# EAGLE schematic DoorOpenerPCB (EAGLE 9.0.1)
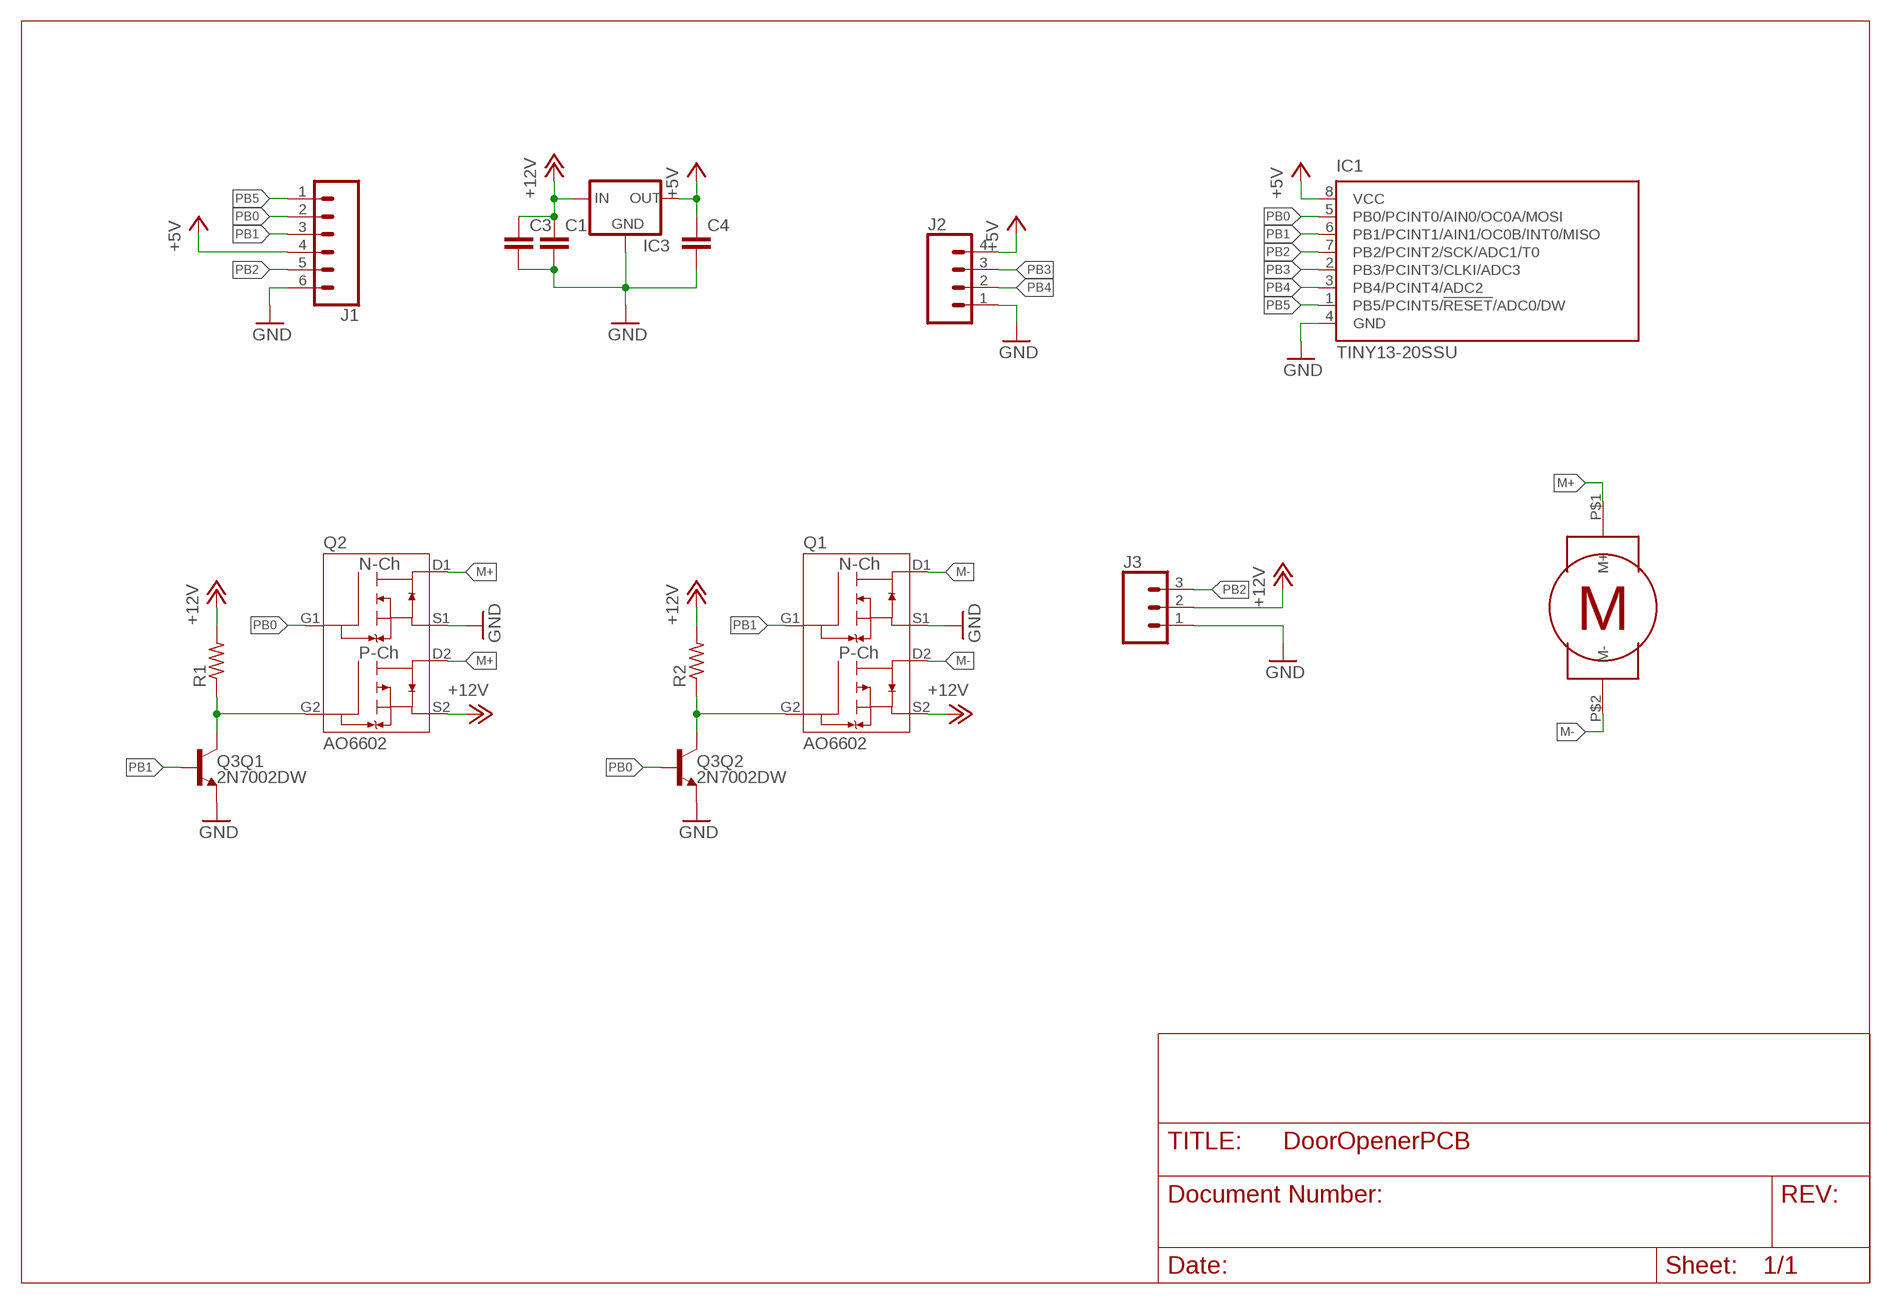
[diagram p0: schematic, sheet 1]

## Parts
C1  C-EUC0805K  [C0805K]
C3  C-EUC0805K  [C0805K]
C4  C-EUC0603K  [C0603K]
IC1  TINY13-20SSU  [8S1]
IC3  78LXX-SOT89R  [SOT89R]
J1  CONN_061.27MM  [1X06_1.27MM]
J2  CONN_041.27MM  [1X04_1.27MM]
J3  CONN_03JST-PTH-NS  [JST-3-PTH-NS]
Q1  AO6602  MOSFET_COMPLIMENTARY_PAIR-DMC2700UDM  [SOT26]
Q2  AO6602  MOSFET_COMPLIMENTARY_PAIR-DMC2700UDM  [SOT26]
Q3  2N7002DW  TRANS_NPN_DUAL-MBT3904DW1T1  [SC70-6]
R1  R-US_R0603  [R0603]
R2  R-US_R0603  [R0603]
U$2  JGY-370  [PKG]

## Nets
+5V: C4.1 IC1.8(VCC) IC3.2(OUT) J1.4 J2.4
+12V: C1.1 C3.1 IC3.1(IN) J3.2 Q1.S2 Q2.S2 R1.2 R2.2
GND: C1.2 C3.2 C4.2 IC1.4(GND) IC3.3(GND) IC3.4(GND) J1.6 J2.1 J3.1 Q1.S1 Q2.S1 Q3.1(Q2:E) Q3.4(Q1:E)
M+: Q2.D1 Q2.D2 U$2.P$1(M+)
M-: Q1.D1 Q1.D2 U$2.P$2(M-)
N$1: Q2.G2 Q3.3(Q1:C) R1.1
N$2: Q1.G2 Q3.6(Q2:C) R2.1
PB0: IC1.5(PB0/PCINT0/AIN0/OC0A/MOSI) J1.2 Q2.G1 Q3.2(Q2:B)
PB1: IC1.6(PB1/PCINT1/AIN1/OC0B/INT0/MISO) J1.3 Q1.G1 Q3.5(Q1:B)
PB2: IC1.7(PB2/PCINT2/SCK/ADC1/T0) J1.5 J3.3
PB3: IC1.2(PB3/PCINT3/CLKI/ADC3) J2.3
PB4: IC1.3(PB4/PCINT4/ADC2) J2.2
PB5: IC1.1(PB5/PCINT5/!RESET!/ADC0/DW) J1.1

## Library data of the parts
C1 C3 C4 = rcl:C-EU: CAPACITOR, European symbol; SPICEPREFIX: C
IC1 = atmel:TINY13: 8-bit AVR Microcontroller with 1K Bytes In-System Programmable Flash Source: http://www.atmel.com/dyn/resources/prod_documents/2535S.pdf; MPN: ATTINY13-20SSU; OC_FARNELL: 1455133; OC_NEWARK: 58M3771
IC3 = v-reg-3:78LXX: VOLTAGE REGULATOR
J1 = SparkFun-Connectors:CONN_06: Multi connection point. Often used as Generic Header-pin footprint for 0.1 inch spaced/style header connections On any of the 0.1 inch spaced packages, you can populate with these: Break Away Headers - Straight <https://www.sparkfun.com/products/116> (PRT-00116) Break Away Male Headers - Right Angle <https://www.sparkfun.com/products/553> (PRT-00553) Female Headers <https://www.sparkfun.com/products/115> (PRT-00115) Break Away Headers - Machine Pin <https://www.sparkfun.com/products/117> (PRT-00117) Break Away Female Headers - Swiss Machine Pin <https://www.sparkfun.com/products/743> (PRT-00743) Arduino Stackable Header - 6 Pin <https://www.sparkfun.com/products/9280> (PRT-09280) For SCREWTERMINALS and SPRING TERMINALS visit here: Screw Terimnals on SparkFun.com <https://www.sparkfun.com/search/results?term=Screw+Terminals> (5mm/3.5mm/2.54mm spacing) This device is also useful as a general connection point to wire up your design to another part of your project. Our various solder wires solder well into these plated through hole pads. Hook-Up Wire - Assortment (Stranded, 22 AWG) <https://www.sparkfun.com/products/11375> (PRT-11375) Hook-Up Wire - Assortment (Solid Core, 22 AWG) <https://www.sparkfun.com/products/11367> (PRT-11367) View the entire wire category on our website here <https://www.sparkfun.com/categories/141>
J2 = SparkFun-Connectors:CONN_04: Multi connection point. Often used as Generic Header-pin footprint for 0.1 inch spaced/style header connections On any of the 0.1 inch spaced packages, you can populate with these: Break Away Headers - Straight <https://www.sparkfun.com/products/116> (PRT-00116) Break Away Male Headers - Right Angle <https://www.sparkfun.com/products/553> (PRT-00553) Female Headers <https://www.sparkfun.com/products/115> (PRT-00115) Break Away Headers - Machine Pin <https://www.sparkfun.com/products/117> (PRT-00117) Break Away Female Headers - Swiss Machine Pin <https://www.sparkfun.com/products/743> (PRT-00743) For SCREWTERMINALS and SPRING TERMINALS visit here: Screw Terimnals on SparkFun.com <https://www.sparkfun.com/search/results?term=Screw+Terminals> (5mm/3.5mm/2.54mm spacing) This device is also useful as a general connection point to wire up your design to another part of your project. Our various solder wires solder well into these plated through hole pads. Hook-Up Wire - Assortment (Stranded, 22 AWG) <https://www.sparkfun.com/products/11375> (PRT-11375) Hook-Up Wire - Assortment (Solid Core, 22 AWG) <https://www.sparkfun.com/products/11367> (PRT-11367) View the entire wire category on our website here <https://www.sparkfun.com/categories/141> Special notes: Molex polarized connector foot print use with SKU : PRT-08231 with associated crimp pins and housings. 1MM SMD Version SKU: PRT-10208
J3 = SparkFun-Connectors:CONN_03: Multi connection point. Often used as Generic Header-pin footprint for 0.1 inch spaced/style header connections On any of the 0.1 inch spaced packages, you can populate with these: Break Away Headers - Straight <https://www.sparkfun.com/products/116> (PRT-00116) Break Away Male Headers - Right Angle <https://www.sparkfun.com/products/553> (PRT-00553) Female Headers <https://www.sparkfun.com/products/115> (PRT-00115) Break Away Headers - Machine Pin <https://www.sparkfun.com/products/117> (PRT-00117) Break Away Female Headers - Swiss Machine Pin <https://www.sparkfun.com/products/743> (PRT-00743) Stackable Header - 3 Pin (Female, 0.1") <https://www.sparkfun.com/products/13875> (PRT-13875) For SCREWTERMINALS and SPRING TERMINALS visit here: Screw Terimnals on SparkFun.com <https://www.sparkfun.com/search/results?term=Screw+Terminals> (5mm/3.5mm/2.54mm spacing) This device is also useful as a general connection point to wire up your design to another part of your project. Our various solder wires solder well into these plated through hole pads. Hook-Up Wire - Assortment (Stranded, 22 AWG) <https://www.sparkfun.com/products/11375> (PRT-11375) Hook-Up Wire - Assortment (Solid Core, 22 AWG) <https://www.sparkfun.com/products/11367> (PRT-11367) View the entire wire category on our website here <https://www.sparkfun.com/categories/141> Special notes: Molex polarized connector foot print use with SKU : PRT-08232 with associated crimp pins and housings.
Q1 Q2 = SparkFun-DiscreteSemi:MOSFET_COMPLIMENTARY_PAIR: Complementary pair enhancement mode MOSFET A P and N channel MOSFET in a single package. Rated to breakdown at 20V Link to datasheet <http://www.diodes.com/_files/datasheets/DMC2700UDM.pdf> SparkFun Products: ZX Distance and Gesture Sensor <https://www.sparkfun.com/products/12780>; PROD_ID: TRANS-11993
Q3 = SparkFun-DiscreteSemi:TRANS_NPN_DUAL: Dual NPN Transistors in Single Package The MBT3904W1 puts two general purpose 3904 NPN transistors in a single package. Datasheet <http://www.onsemi.com/pub_link/Collateral/MBT3904DW1T1-D.PDF> SparkFun Products: SparkFun ESP32 Thing <https://www.sparkfun.com/products/13907>; PROD_ID: TRANS-13337
R1 R2 = rcl:R-US_: RESISTOR, American symbol; SPICEPREFIX: R
U$2 = mot:JGY-370